# Altium schematic sheet 04_H3STORAGE.SchDoc
size A2
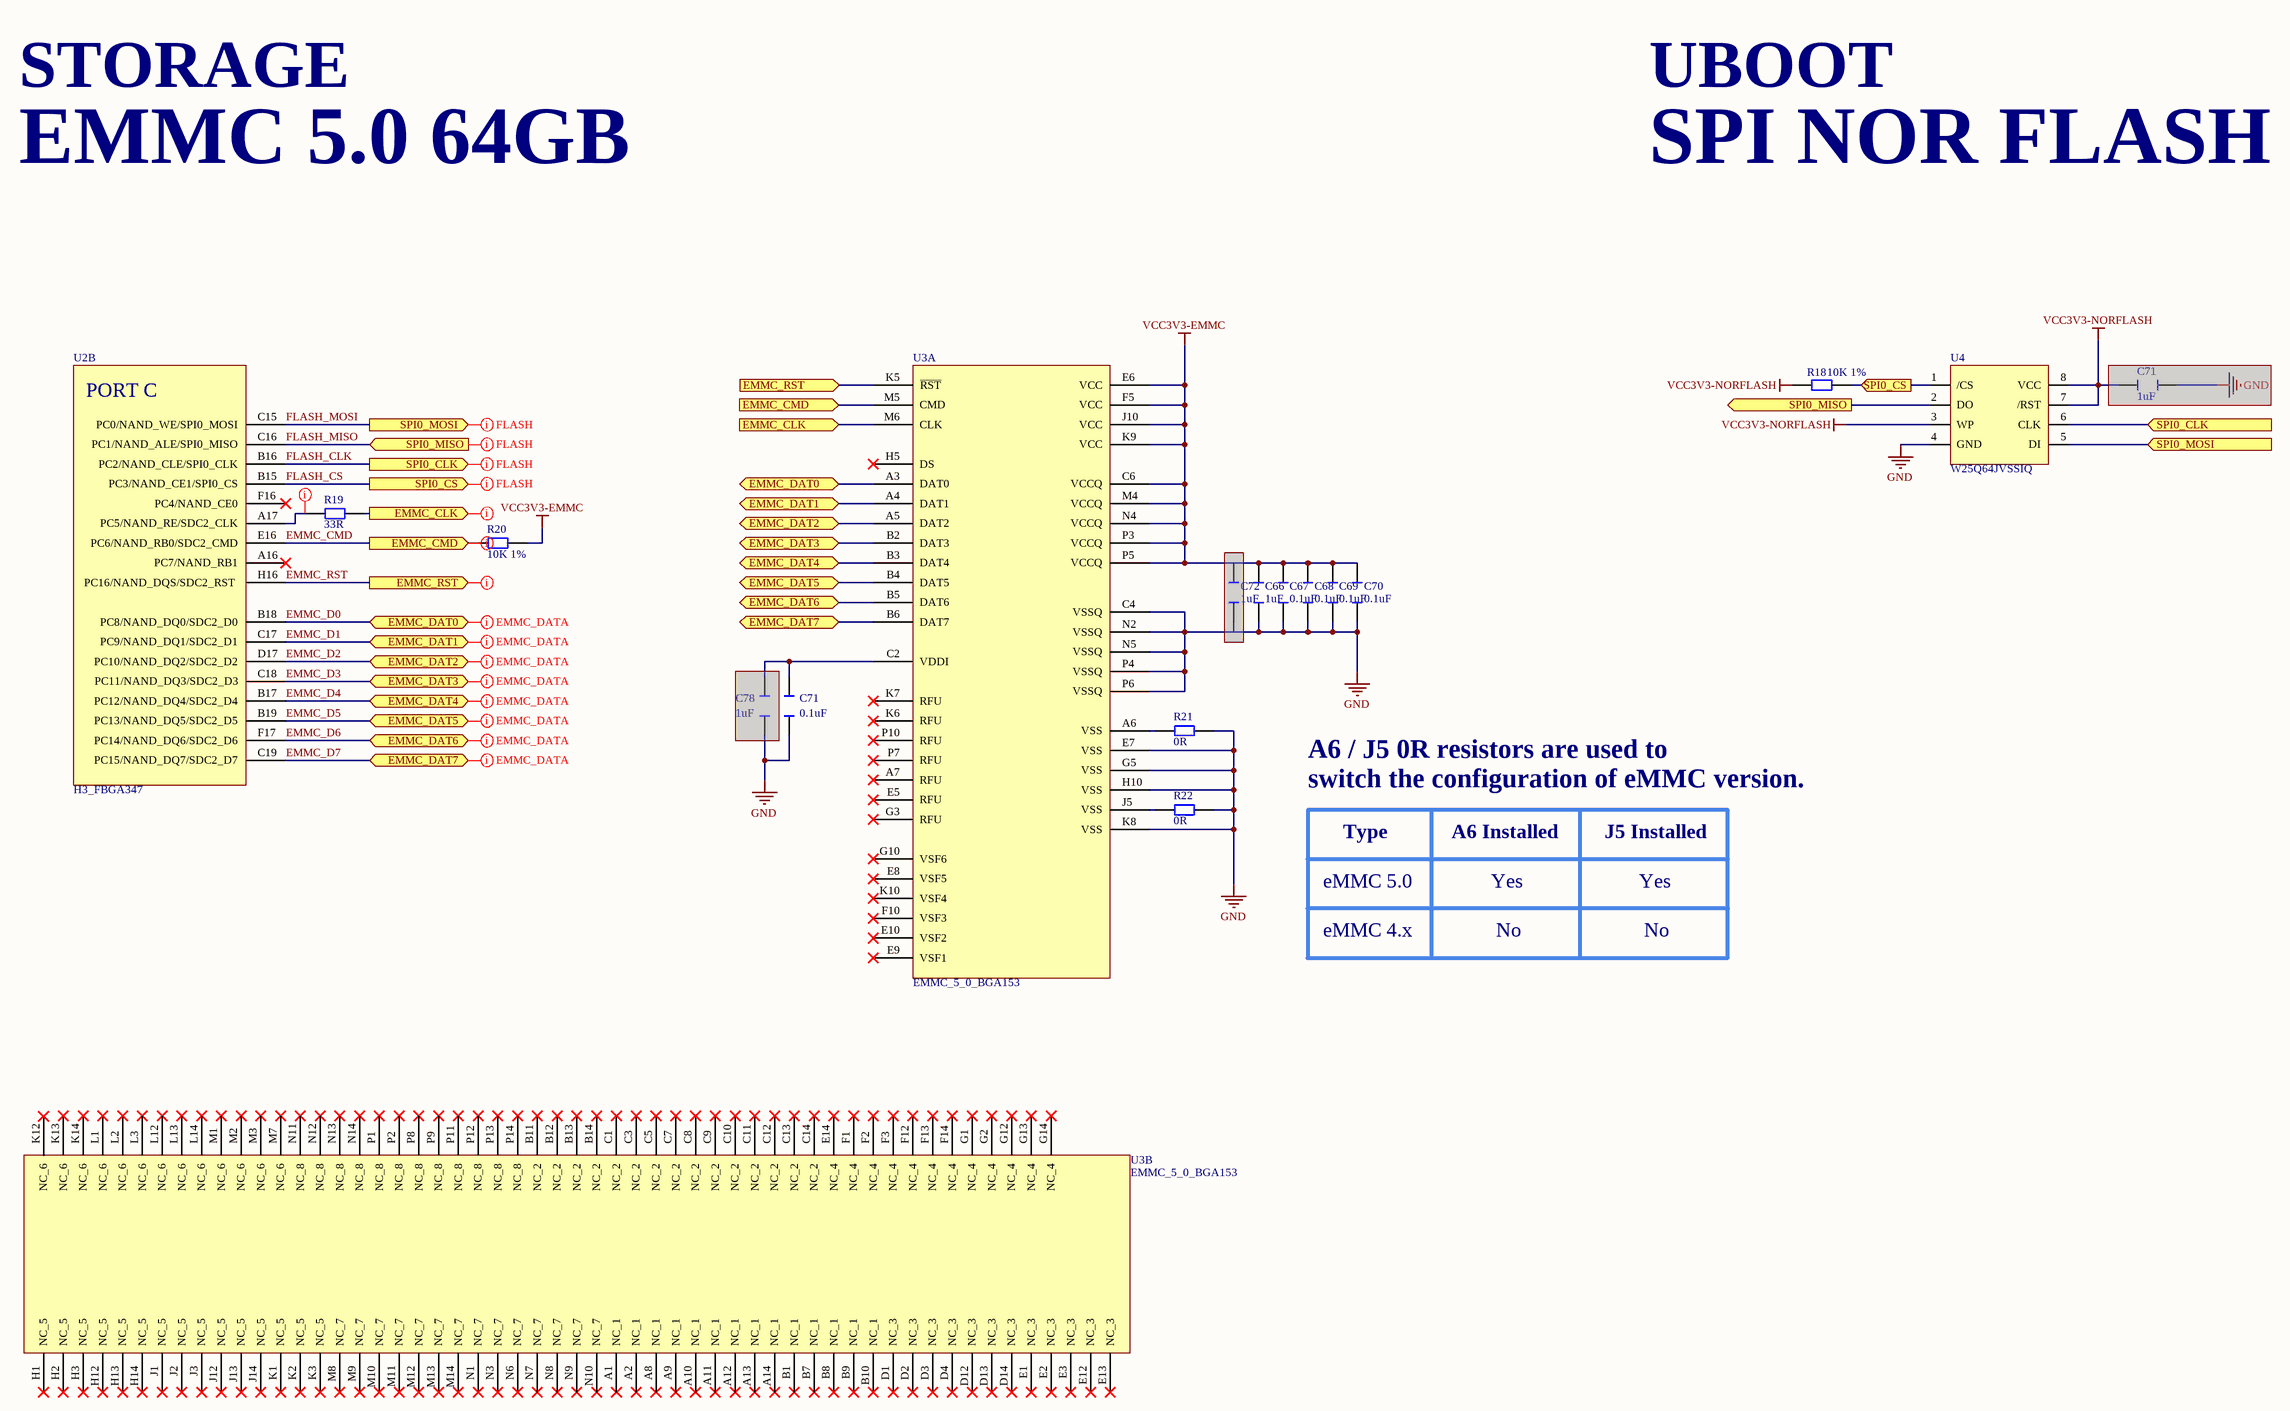
[diagram p0: 04_H3STORAGE.SchDoc]

## Parts
(Parts that share a designator on the sheet are numbered #1, #2 ... from top to bottom, then left to right.)
C66  1uF  [C0402]
C67  0.1uF  [C0402]
C68  0.1uF  [C0402]
C69  0.1uF  [C0402]
C70  0.1uF  [C0402]
C71#1  1uF  [C0402]  (masked out: inside a compile mask, not in the netlist)
C71#2  0.1uF  [C0603]
C72  1uF  [C0402]  (masked out: inside a compile mask, not in the netlist)
C78  1uF  [C0402]  (masked out: inside a compile mask, not in the netlist)
R18  10K 1%  [R0402]
R19  33R  [R0402]
R20  10K 1%  [R0402]
R21  0R  [R0402]
R22  0R  [R0402]
U2  H3_FBGA347  [H3_FBGA327]  (part B of 16)
U3  EMMC_5_0_BGA153  [EMMC_BGA153]  (parts A,B of 2)
U4  W25Q64JVSSIQ  [W25Q64JVSSIQ]

## Ports
EMMC_CLK (in), EMMC_CLK (out), EMMC_CMD (in), EMMC_CMD (out), EMMC_DAT0 (bidir), EMMC_DAT1 (bidir), EMMC_DAT2 (bidir), EMMC_DAT3 (bidir), EMMC_DAT4 (bidir), EMMC_DAT5 (bidir), EMMC_DAT6 (bidir), EMMC_DAT7 (bidir), EMMC_RST (in), EMMC_RST (out), SPI0_CLK (in), SPI0_CLK (out), SPI0_CS (in), SPI0_CS (out), SPI0_MISO (in), SPI0_MISO (out), SPI0_MOSI (in), SPI0_MOSI (out)

## Nets
GND: C66.1 C67.1 C68.1 C69.1 C70.1 C71#2.1 R21.2 R22.2 U3.C4(VSSQ) U3.E7(VSS) U3.G5(VSS) U3.H10(VSS) U3.K8(VSS) U3.N2(VSSQ) U3.N5(VSSQ) U3.P4(VSSQ) U3.P6(VSSQ) U4.4(GND)
VCC3V3-EMMC: C66.2 C67.2 C68.2 C69.2 C70.2 R20.2 U3.C6(VCCQ) U3.E6(VCC) U3.F5(VCC) U3.J10(VCC) U3.K9(VCC) U3.M4(VCCQ) U3.N4(VCCQ) U3.P3(VCCQ) U3.P5(VCCQ)
VCC3V3-NORFLASH: R18.1 U4.3(WP) U4.7(/RST) U4.8(VCC)
EMMC_CLK: R19.2 U3.M6(CLK) ; port EMMC_CLK
EMMC_CMD: R20.1 U2.E16(PC6/NAND_RB0/SDC2_CMD) U3.M5(CMD) ; port EMMC_CMD
EMMC_D0: U2.B18(PC8/NAND_DQ0/SDC2_D0) U3.A3(DAT0) ; port EMMC_DAT0
EMMC_D1: U2.C17(PC9/NAND_DQ1/SDC2_D1) U3.A4(DAT1) ; port EMMC_DAT1
EMMC_D2: U2.D17(PC10/NAND_DQ2/SDC2_D2) U3.A5(DAT2) ; port EMMC_DAT2
EMMC_D3: U2.C18(PC11/NAND_DQ3/SDC2_D3) U3.B2(DAT3) ; port EMMC_DAT3
EMMC_D4: U2.B17(PC12/NAND_DQ4/SDC2_D4) U3.B3(DAT4) ; port EMMC_DAT4
EMMC_D5: U2.B19(PC13/NAND_DQ5/SDC2_D5) U3.B4(DAT5) ; port EMMC_DAT5
EMMC_D6: U2.F17(PC14/NAND_DQ6/SDC2_D6) U3.B5(DAT6) ; port EMMC_DAT6
EMMC_D7: U2.C19(PC15/NAND_DQ7/SDC2_D7) U3.B6(DAT7) ; port EMMC_DAT7
EMMC_RST: U2.H16(PC16/NAND_DQS/SDC2_RST) U3.K5(~{RST}) ; port EMMC_RST
FLASH_CLK: U2.B16(PC2/NAND_CLE/SPI0_CLK) U4.6(CLK) ; port SPI0_CLK
FLASH_CS: R18.2 U2.B15(PC3/NAND_CE1/SPI0_CS) U4.1(/CS) ; port SPI0_CS
FLASH_MISO: U2.C16(PC1/NAND_ALE/SPI0_MISO) U4.2(DO) ; port SPI0_MISO
FLASH_MOSI: U2.C15(PC0/NAND_WE/SPI0_MOSI) U4.5(DI) ; port SPI0_MOSI
NetC71#2_2: C71#2.2 U3.C2(VDDI)
NetR19_1: R19.1 U2.A17(PC5/NAND_RE/SDC2_CLK)
NetR21_1: R21.1 U3.A6(VSS)
NetR22_1: R22.1 U3.J5(VSS)

Not connected (* = marked no-connect by the designer): U2 A16(PC7/NAND_RB1)* F16(PC4/NAND_CE0)*; U3 A1(NC_1)* A2(NC_1)* A7(RFU)* A8(NC_1)* A9(NC_1)* A10(NC_1)* A11(NC_1)* A12(NC_1)* A13(NC_1)* A14(NC_1)* B1(NC_1)* B7(NC_1)* B8(NC_1)* B9(NC_1)* B10(NC_1)* B11(NC_2)* B12(NC_2)* B13(NC_2)* B14(NC_2)* C1(NC_2)* C3(NC_2)* C5(NC_2)* C7(NC_2)* C8(NC_2)* C9(NC_2)* C10(NC_2)* C11(NC_2)* C12(NC_2)* C13(NC_2)* C14(NC_2)* D1(NC_3)* D2(NC_3)* D3(NC_3)* D4(NC_3)* D12(NC_3)* D13(NC_3)* D14(NC_3)* E1(NC_3)* E2(NC_3)* E3(NC_3)* E5(RFU)* E8(VSF5)* E9(VSF1)* E10(VSF2)* E12(NC_3)* E13(NC_3)* E14(NC_4)* F1(NC_4)* F2(NC_4)* F3(NC_4)* F10(VSF3)* F12(NC_4)* F13(NC_4)* F14(NC_4)* G1(NC_4)* G2(NC_4)* G3(RFU)* G10(VSF6)* G12(NC_4)* G13(NC_4)* G14(NC_4)* H1(NC_5)* H2(NC_5)* H3(NC_5)* H5(DS)* H12(NC_5)* H13(NC_5)* H14(NC_5)* J1(NC_5)* J2(NC_5)* J3(NC_5)* J12(NC_5)* J13(NC_5)* J14(NC_5)* K1(NC_5)* K2(NC_5)* K3(NC_5)* K6(RFU)* K7(RFU)* K10(VSF4)* K12(NC_6)* K13(NC_6)* K14(NC_6)* L1(NC_6)* L2(NC_6)* L3(NC_6)* L12(NC_6)* L13(NC_6)* L14(NC_6)* M1(NC_6)* M2(NC_6)* M3(NC_6)* M7(NC_6)* M8(NC_7)* M9(NC_7)* M10(NC_7)* M11(NC_7)* M12(NC_7)* M13(NC_7)* M14(NC_7)* N1(NC_7)* N3(NC_7)* N6(NC_7)* N7(NC_7)* N8(NC_7)* N9(NC_7)* N10(NC_7)* N11(NC_8)* N12(NC_8)* N13(NC_8)* N14(NC_8)* P1(NC_8)* P2(NC_8)* P7(RFU)* P8(NC_8)* P9(NC_8)* P10(RFU)* P11(NC_8)* P12(NC_8)* P13(NC_8)* P14(NC_8)*

## Layout directives
net class EMMC_DATA; rule Width Constraint [Pref Width = 5mil    Min Width = 4mil    Max Width = 5mil]: EMMC_D0, EMMC_D1, EMMC_D2, EMMC_D3, EMMC_D4, EMMC_D5, EMMC_D6, EMMC_D7
net class FLASH; rule Width Constraint [Pref Width = 5mil    Min Width = 4mil    Max Width = 5mil]: FLASH_CLK, FLASH_CS, FLASH_MISO, FLASH_MOSI
net class EMMC_CTL; rule Width Constraint [Pref Width = 0.127mm    Min Width = 0.127mm    Max Width = 0.127mm]: EMMC_CLK, EMMC_CMD, EMMC_RST, NetR19_1

## Notes on the sheet
- STORAGE
- UBOOT
- EMMC 5.0 64GB
- SPI NOR FLASH
- A6 / J5 0R resistors are used to
- switch the configuration of eMMC version.
- Type
- A6 Installed
- J5 Installed
- eMMC 5.0
- Yes
- eMMC 4.x
- No
- (in symbol H3_FBGA347, part B) PORT C

## Library data of the parts
C66 C71#1 C72 C78 = C_1UF
C67-C70 C71#2 = C_0.1UF
R18 R20 = R_10K_P1
R19 = R_33R
R21 R22 = R_0R